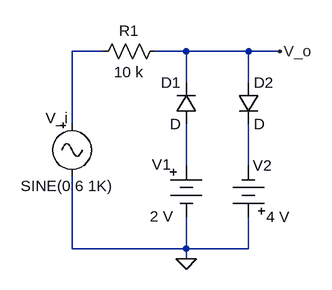
[diagram p0: schematic fig1.asc]
fig1.asc, the LTspice schematic file:
Version 4
SHEET 1 880 680
WIRE 16 144 -32 144
WIRE 144 144 96 144
WIRE 240 144 144 144
WIRE 288 144 240 144
WIRE 144 192 144 144
WIRE 240 192 240 144
WIRE -32 256 -32 144
WIRE 144 320 144 256
WIRE 240 320 240 256
WIRE -32 448 -32 336
WIRE 144 448 144 400
WIRE 144 448 -32 448
WIRE 240 448 240 400
WIRE 240 448 144 448
WIRE 144 464 144 448
FLAG 144 464 0
FLAG 288 144 V_o
SYMBOL res 112 128 R90
WINDOW 0 0 56 VBottom 2
WINDOW 3 32 56 VTop 2
SYMATTR InstName R1
SYMATTR Value 10 k
SYMBOL diode 224 192 R0
SYMATTR InstName D2
SYMBOL diode 160 256 R180
WINDOW 0 24 64 Left 2
WINDOW 3 24 0 Left 2
SYMATTR InstName D1
SYMBOL Misc\\battery 144 304 R0
WINDOW 0 -53 14 Left 2
WINDOW 3 -56 94 Left 2
SYMATTR InstName V1
SYMATTR Value 2 V
SYMBOL Misc\\battery 240 416 R180
WINDOW 0 -36 96 Left 2
WINDOW 3 -63 17 Left 2
SYMATTR InstName V2
SYMATTR Value 4 V
SYMBOL Misc\\signal -32 240 R0
WINDOW 0 -41 7 Left 2
WINDOW 3 -79 111 Left 2
SYMATTR InstName V_i
SYMATTR Value SINE(0 6 1K)

The netlist it stands for:
* fig1.asc
R1 V_o N001 10 k
D2 V_o N003 D
D1 N002 V_o D
V1 N002 0 2 V
V2 0 N003 4 V
V_i N001 0 SINE(0 6 1K)
.model D D
.lib standard.dio
.backanno
.end